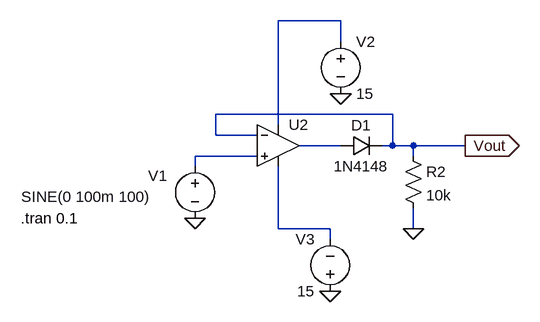
[diagram p0: schematic Half_Wave_Rectifier.asc]
Half_Wave_Rectifier.asc, the LTspice schematic file:
Version 4
SHEET 1 880 680
WIRE 272 -16 176 -16
WIRE 272 16 272 -16
WIRE 352 128 80 128
WIRE 176 144 176 -16
WIRE 80 160 80 128
WIRE 144 160 80 160
WIRE 272 176 208 176
WIRE 352 176 352 128
WIRE 352 176 336 176
WIRE 384 176 352 176
WIRE 464 176 384 176
WIRE 144 192 48 192
WIRE 384 192 384 176
WIRE 48 208 48 192
WIRE 176 304 176 208
WIRE 256 304 176 304
WIRE 384 304 384 272
WIRE 256 320 256 304
FLAG 48 288 0
FLAG 256 400 0
FLAG 272 96 0
FLAG 464 176 Vout
IOPIN 464 176 Out
FLAG 384 304 0
SYMBOL res 368 176 R0
SYMATTR InstName R2
SYMATTR Value 10k
SYMBOL diode 272 192 R270
WINDOW 0 32 32 VTop 2
WINDOW 3 0 32 VBottom 2
SYMATTR InstName D1
SYMATTR Value 1N4148
SYMBOL voltage 48 192 R0
WINDOW 0 -72 30 Left 2
WINDOW 3 -267 63 Left 2
WINDOW 123 0 0 Left 0
WINDOW 39 0 0 Left 0
SYMATTR InstName V1
SYMATTR Value SINE(0 100m 100)
SYMBOL voltage 272 0 R0
WINDOW 123 0 0 Left 0
WINDOW 39 0 0 Left 0
SYMATTR InstName V2
SYMATTR Value 15
SYMBOL voltage 256 416 R180
WINDOW 0 24 96 Left 2
WINDOW 3 24 16 Left 2
WINDOW 123 0 0 Left 0
WINDOW 39 0 0 Left 0
SYMATTR InstName V3
SYMATTR Value 15
SYMBOL OpAmps\\UniversalOpamp2 176 176 R0
SYMATTR InstName U2
TEXT -220 288 Left 2 !.tran 0.1

The netlist it stands for:
* Half_Wave_Rectifier.asc
R2 Vout 0 10k
D1 N002 Vout 1N4148
V1 N003 0 SINE(0 100m 100)
V2 N001 0 15
V3 0 N004 15
XU2 N003 Vout N001 N004 N002 level.2 Avol=1Meg GBW=10Meg Slew=10Meg ilimit=25m rail=0 Vos=0 phimargin=45 en=0 enk=0 in=0 ink=0 Rin=500Meg  ; pins IN+ IN- V+ V- OUT
.model D D
.lib standard.dio
.tran 0.1
.lib UniversalOpamps2.sub
.backanno
.end